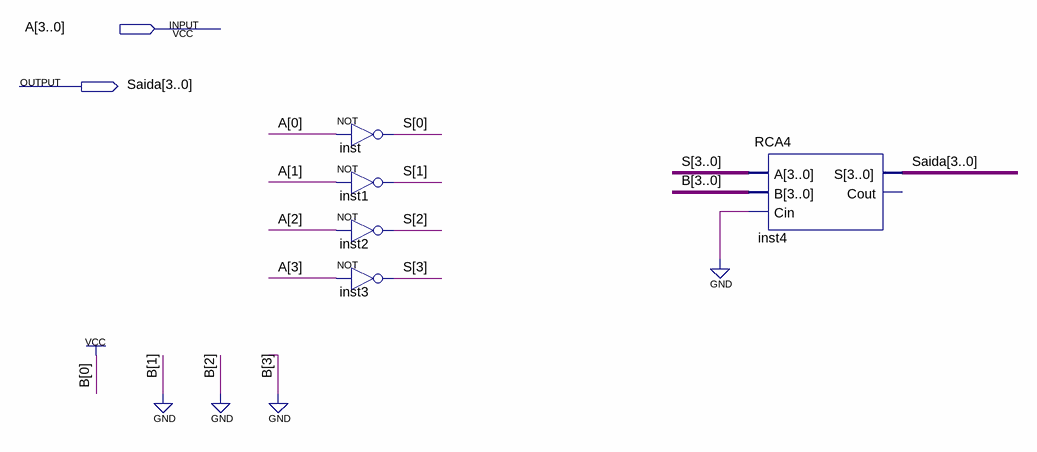
[diagram p0: schematic sheet]
// Quartus schematic NEGATIVE4b.bdf as structural Verilog: 5 symbols, 2 pins
module NEGATIVE4b (
  input  [3:0] A,
  output [3:0] Saida
);

  wire [3:0] S;

  not inst (S[0], A[0]);
  not inst1 (S[1], A[1]);
  not inst2 (S[2], A[2]);
  not inst3 (S[3], A[3]);
  RCA4 inst4 (.A(S), .B(4'b0001), .Cin(1'b0), .S(Saida));  // open: Cout
endmodule
